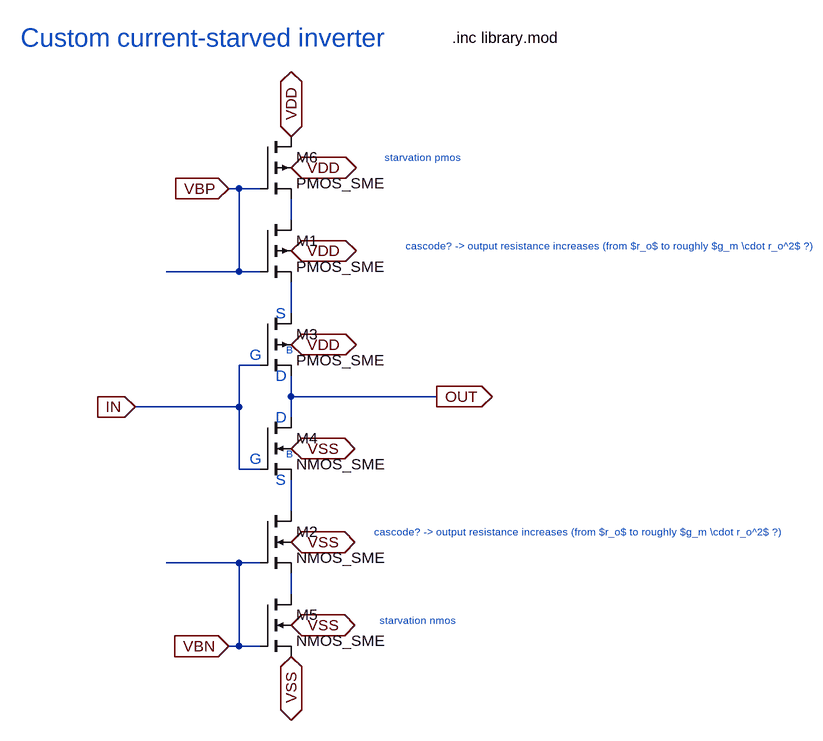
[diagram p0: schematic my_current_starved_inverter.asc]
my_current_starved_inverter.asc, the LTspice schematic file:
Version 4.1
SHEET 1 1424 920
WIRE 496 80 480 80
WIRE 528 80 496 80
WIRE 576 128 576 96
WIRE 496 208 496 80
WIRE 496 208 384 208
WIRE 528 208 496 208
WIRE 576 272 576 224
WIRE 528 352 496 352
WIRE 576 400 576 368
WIRE 800 400 576 400
WIRE 496 416 496 352
WIRE 496 416 336 416
WIRE 576 432 576 400
WIRE 496 512 496 416
WIRE 528 512 496 512
WIRE 576 576 576 528
WIRE 496 656 384 656
WIRE 528 656 496 656
WIRE 576 704 576 672
WIRE 496 784 496 656
WIRE 496 784 480 784
WIRE 528 784 496 784
FLAG 576 320 VDD
IOPIN 576 320 BiDir
FLAG 576 480 VSS
IOPIN 576 480 BiDir
FLAG 800 400 OUT
IOPIN 800 400 Out
FLAG 336 416 IN
IOPIN 336 416 In
FLAG 576 624 VSS
IOPIN 576 624 BiDir
FLAG 576 176 VDD
IOPIN 576 176 BiDir
FLAG 576 0 VDD
IOPIN 576 0 BiDir
FLAG 576 800 VSS
IOPIN 576 800 BiDir
FLAG 480 80 VBP
IOPIN 480 80 In
FLAG 480 784 VBN
IOPIN 480 784 In
FLAG 576 752 VSS
IOPIN 576 752 BiDir
FLAG 576 48 VDD
IOPIN 576 48 BiDir
SYMBOL pmos4 528 272 R0
SYMATTR InstName M3
SYMATTR Value PMOS_SME
SYMATTR Value2 l=0.35u w=1.2u
SYMBOL nmos4 528 432 R0
SYMATTR InstName M4
SYMATTR Value NMOS_SME
SYMATTR Value2 l=0.35u w=0.4u
SYMBOL pmos4 528 128 R0
SYMATTR InstName M1
SYMATTR Value PMOS_SME
SYMATTR Value2 l=2u w=2.35u
SYMBOL nmos4 528 576 R0
SYMATTR InstName M2
SYMATTR Value NMOS_SME
SYMATTR Value2 l=2u w=0.4u
SYMBOL nmos4 528 704 R0
SYMATTR InstName M5
SYMATTR Value NMOS_SME
SYMATTR Value2 l=2u w=0.4u
SYMBOL pmos4 528 0 R0
SYMATTR InstName M6
SYMATTR Value PMOS_SME
SYMATTR Value2 l=2u w=2.35u
TEXT 552 272 Left 2 ;S
TEXT 552 528 Left 2 ;S
TEXT 552 368 Left 2 ;D
TEXT 552 432 Left 2 ;D
TEXT 512 336 Left 2 ;G
TEXT 512 496 Left 2 ;G
TEXT 568 328 Left 1 ;B
TEXT 568 488 Left 1 ;B
TEXT 824 -152 Left 2 !.inc library.mod
TEXT 160 -152 Left 4 ;Custom current-starved inverter
TEXT 704 608 Left 1 ;cascode? -> output resistance increases (from $r_o$ to roughly $g_m \\cdot r_o^2$ ?)
TEXT 752 168 Left 1 ;cascode? -> output resistance increases (from $r_o$ to roughly $g_m \\cdot r_o^2$ ?)
TEXT 720 32 Left 1 ;starvation pmos
TEXT 712 744 Left 1 ;starvation nmos

The netlist it stands for:
* my_current_starved_inverter.asc
M3 N002 IN OUT VDD PMOS_SME l=0.35u w=1.2u
M4 OUT IN N003 VSS NMOS_SME l=0.35u w=0.4u
M1 N001 VBP N002 VDD PMOS_SME l=2u w=2.35u
M2 N003 VBN N004 VSS NMOS_SME l=2u w=0.4u
M5 N004 VBN VSS VSS NMOS_SME l=2u w=0.4u
M6 VDD VBP N001 VDD PMOS_SME l=2u w=2.35u
.model NMOS NMOS
.model PMOS PMOS
.lib standard.mos
* S
* S
* D
* D
* G
* G
* B
* B
.inc library.mod
* Custom current-starved inverter
* cascode? -> output resistance increases (from $r_o$ to roughly $g_m \cdot r_o^2$ ?)
* cascode? -> output resistance increases (from $r_o$ to roughly $g_m \cdot r_o^2$ ?)
* starvation pmos
* starvation nmos
.backanno
.end